# Altium project MPPT+invertor .PrjPcb
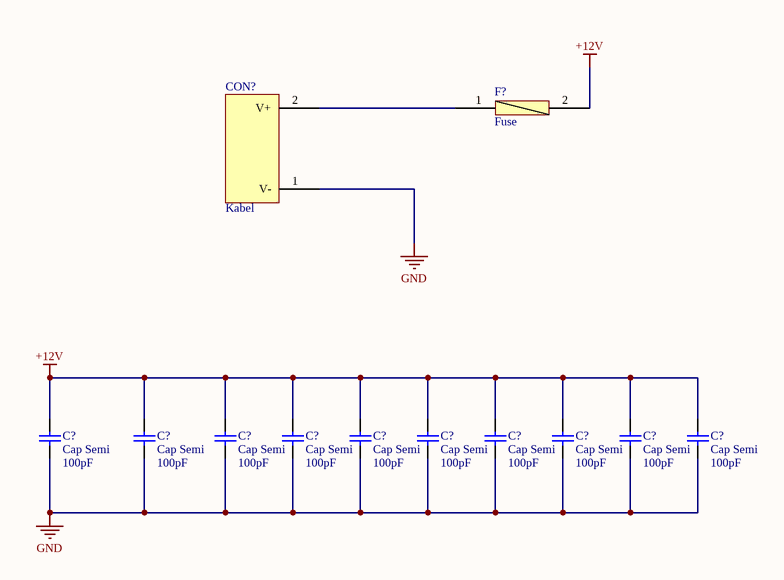
[diagram p0: Input.SchDoc]
1 sheet, 12 parts. Net scope: global (net labels, ports and power ports of the same name join across sheets).

## Sheet Input.SchDoc
size A

### Parts
(Parts that share a designator on the sheet are numbered #1, #2 ... from top to bottom, then left to right.)
C?#1  Cap Semi  value 100pF  [C1206]
C?#2  Cap Semi  value 100pF  [C1206]
C?#3  Cap Semi  value 100pF  [C1206]
C?#4  Cap Semi  value 100pF  [C1206]
C?#5  Cap Semi  value 100pF  [C1206]
C?#6  Cap Semi  value 100pF  [C1206]
C?#7  Cap Semi  value 100pF  [C1206]
C?#8  Cap Semi  value 100pF  [C1206]
C?#9  Cap Semi  value 100pF  [C1206]
C?#10  Cap Semi  value 100pF  [C1206]
CON?  Kabel  [Conector Voeding]
F?  Fuse  [Fuse]

### Nets
+12V: C?#1.1 C?#2.1 C?#3.1 C?#4.1 C?#5.1 C?#6.1 C?#7.1 C?#8.1 C?#9.1 C?#10.1 F?.2
GND: C?#1.2 C?#2.2 C?#3.2 C?#4.2 C?#5.2 C?#6.2 C?#7.2 C?#8.2 C?#9.2 C?#10.2 CON?.1(V-)
NetCON?_2: CON?.2(V+) F?.1

### Library data of the parts
C?#1-C?#10 = Cap Semi: Capacitor (Semiconductor SIM Model); Published: 8-Jun-2000; LatestRevisionDate: 29-May-2009; LatestRevisionNote: IPC-7351 Footprint Added.; PackageReference: C1206; Publisher: Altium Limited; PackageDescription: Chip Capacitor